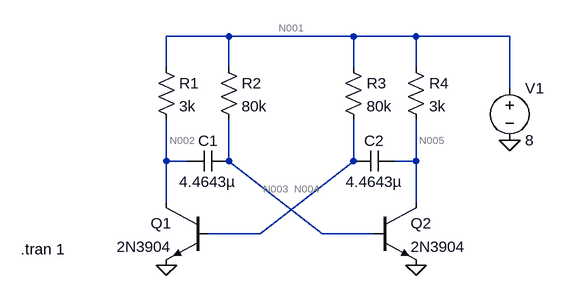
[diagram p0: schematic Draft1.asc]
Draft1.asc, the LTspice schematic file:
Version 4
SHEET 1 880 680
WIRE 144 -32 48 -32
WIRE 336 -32 144 -32
WIRE 432 -32 336 -32
WIRE 576 -32 432 -32
WIRE 48 16 48 -32
WIRE 144 16 144 -32
WIRE 336 16 336 -32
WIRE 432 16 432 -32
WIRE 576 48 576 -32
WIRE 48 160 48 96
WIRE 80 160 48 160
WIRE 144 160 144 96
WIRE 336 160 336 96
WIRE 432 160 432 96
WIRE 432 160 400 160
WIRE 48 224 48 160
WIRE 432 224 432 160
WIRE 192 272 336 160
WIRE 192 272 112 272
WIRE 288 272 144 160
WIRE 368 272 288 272
FLAG 48 320 0
FLAG 432 320 0
FLAG 576 128 0
SYMBOL npn 368 224 R0
SYMATTR InstName Q2
SYMATTR Value 2N3904
SYMBOL npn 112 224 M0
SYMATTR InstName Q1
SYMATTR Value 2N3904
SYMBOL res 32 0 R0
SYMATTR InstName R1
SYMATTR Value 3k
SYMBOL res 128 0 R0
SYMATTR InstName R2
SYMATTR Value 80k
SYMBOL res 320 0 R0
SYMATTR InstName R3
SYMATTR Value 80k
SYMBOL res 416 0 R0
SYMATTR InstName R4
SYMATTR Value 3k
SYMBOL cap 144 144 R90
WINDOW 0 0 32 VBottom 2
WINDOW 3 32 32 VTop 2
SYMATTR InstName C1
SYMATTR Value 4.4643µ
SYMBOL cap 400 144 R90
WINDOW 0 0 32 VBottom 2
WINDOW 3 32 32 VTop 2
SYMATTR InstName C2
SYMATTR Value 4.4643µ
SYMBOL voltage 576 32 R0
WINDOW 123 0 0 Left 0
WINDOW 39 0 0 Left 0
SYMATTR InstName V1
SYMATTR Value 8
TEXT -176 296 Left 2 !.tran 1

The netlist it stands for:
* Draft1.asc
Q2 N005 N003 0 0 2N3904
Q1 N002 N004 0 0 2N3904
R1 N001 N002 3k
R2 N001 N003 80k
R3 N001 N004 80k
R4 N001 N005 3k
C1 N003 N002 4.4643µ
C2 N005 N004 4.4643µ
V1 N001 0 8
.model NPN NPN
.model PNP PNP
.lib standard.bjt
.tran 1
.backanno
.end

* Results of the author's LTspice run, read from the files saved beside the schematic
* Operating Point, zero values left out:
*   V(n005) = 58.84 mV
*   V(n003) = 686.4 mV
*   V(n002) = 58.84 mV
*   V(n004) = 686.4 mV
*   V(n001) = 8 V
*   Ic(Q2) = 2.647 mA
*   Ib(Q2) = 91.42 µA
*   Ie(Q2) = -2.738 mA
*   Ic(Q1) = 2.647 mA
*   Ib(Q1) = 91.42 µA
*   Ie(Q1) = -2.738 mA
*   I(R1) = 2.647 mA
*   I(R2) = 91.42 µA
*   I(R3) = 91.42 µA
*   I(R4) = 2.647 mA
*   I(V1) = -5.477 mA
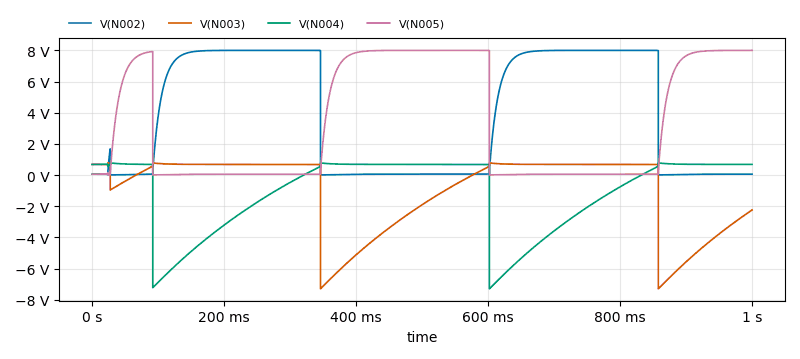
[diagram p1: Transient Analysis of Draft1.asc, plotted from the saved traces]
* Transient Analysis, 1 run:
*   V(N002): min 11.91 mV, max 8 V, average 3.899 V, rms 5.487 V, last 60.06 mV
*   V(N003): min -7.292 V, max 780.9 mV, average -1.028 V, rms 2.645 V, last -2.24 V
*   V(N004): min -7.292 V, max 782 mV, average -1.125 V, rms 2.649 V, last 687.5 mV
*   V(N005): min 11.96 mV, max 8 V, average 3.412 V, rms 5.077 V, last 8 V